# Altium project 6301 Lab 3.PrjPcb
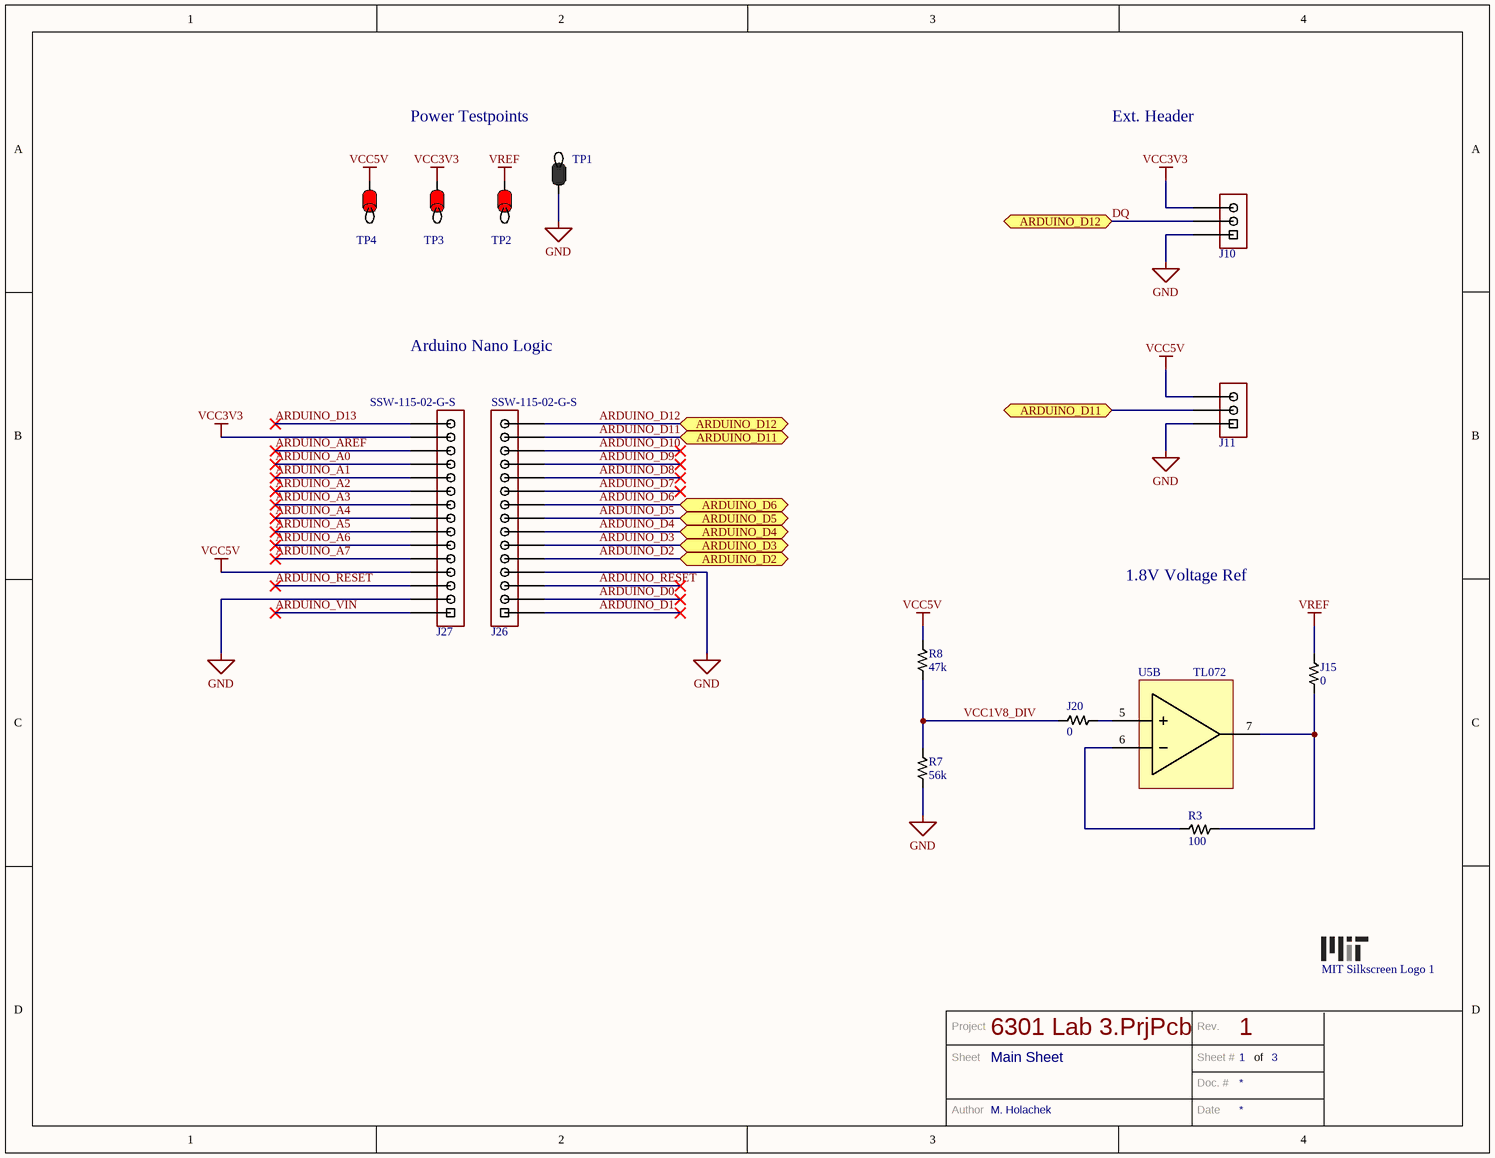
[diagram p0: 6301 Lab3 Main.SchDoc]
3 sheets, 54 parts. Net scope: flat (ports and power ports of the same name join across sheets).
Board file: 6301 Lab3 FF.PcbDoc
Sheets:
  6301 Lab3 Main.SchDoc
  6301 Lab3 ADC.SchDoc
  6301 Lab3 PTAT.SchDoc

## Sheet 6301 Lab3 Main.SchDoc: Main Sheet
size Letter; Author: M. Holachek; Revision: 1; SheetNumber: 1; SheetTotal: 3

### Parts
J10  Short  [1X03]  (value not drawn)
J11  Short  [1X03]  (value not drawn)
J15  0  [JUMP0402]
J20  0  [JUMP0402]
J26  SSW-115-02-G-S  [1x15]
J27  SSW-115-02-G-S  [1x15]
MIT_Silkscreen_Logo_1  MIT Logo  [MITLOGO]  (value not drawn)  (no BOM)
R3  100  [RES0805]
R7  56k  [RES0805]
R8  47k  [RES0805]
TP1  Black  [TP_BLACK]  (value not drawn)
TP2  Red  [TP_RED]  (value not drawn)
TP3  Red  [TP_RED]  (value not drawn)
TP4  Red  [TP_RED]  (value not drawn)
U5  TL072  [SOIC8]  (part B of 2)

### Ports
ARDUINO_D2, ARDUINO_D3, ARDUINO_D4, ARDUINO_D5, ARDUINO_D6, ARDUINO_D11, ARDUINO_D12

### Nets
GND: J10.1 J11.1 J26.4 J27.2 R7.1 TP1.1
VCC3V3: J10.3 J27.14 TP3.1
VCC5V: J11.3 J27.4 R8.2 TP4.1
VREF: J15.2 TP2.1
ARDUINO_A0: J27.12
ARDUINO_A1: J27.11
ARDUINO_A2: J27.10
ARDUINO_A3: J27.9
ARDUINO_A4: J27.8
ARDUINO_A5: J27.7
ARDUINO_A6: J27.6
ARDUINO_A7: J27.5
ARDUINO_AREF: J27.13
ARDUINO_D0: J26.2
ARDUINO_D1: J26.1
ARDUINO_D2: J26.5 ; port ARDUINO_D2  [project net ADC_OUT]
ARDUINO_D3: J26.6 ; port ARDUINO_D3
ARDUINO_D4: J26.7 ; port ARDUINO_D4
ARDUINO_D5: J26.8 ; port ARDUINO_D5
ARDUINO_D6: J26.9 ; port ARDUINO_D6
ARDUINO_D7: J26.10
ARDUINO_D8: J26.11
ARDUINO_D9: J26.12
ARDUINO_D10: J26.13
ARDUINO_D11: J11.2 J26.14 ; port ARDUINO_D11
ARDUINO_D12: J10.2 J26.15 ; port ARDUINO_D12  [also labelled DQ]
ARDUINO_D13: J27.15
ARDUINO_RESET: J26.3 J27.3
ARDUINO_VIN: J27.1
VCC1V8_DIV: J20.1 R7.2 R8.1
NetJ15_1: J15.1 R3.1 U5.7(2OUT)
NetJ20_2: J20.2 U5.5(2IN+)
NetR3_2: R3.2 U5.6(2IN-)

### Notes on the sheet
- Power Testpoints
- Ext. Header
- Arduino Nano Logic
- 1.8V Voltage Ref
- Project
- Rev.
- Sheet
- Author
- Doc. #
- Sheet #
- Date
- of

### Library data of the parts
J10 J11 = 1x3: 1x3 2.54mm Standard Connector
J15 J20 = Jumper 0402: Jumper, 0402 Package
J26 J27 = 1x15: 1x15 2.54mm Standard Connector
R3 R8 = Resistor: Resistor, 0805 Package; Temp Co: +/- 25ppm; Tolerance: 1%
  R8: Digikey P/N: RG20P499KBCT-ND
R7 = Resistor: Resistor, 0805 Package; Temp Co: +/- 25ppm; Tolerance: 0.1%; Digikey P/N: RG20P499KBCT-ND
TP1 = Black Test Point
TP2-TP4 = Red Test Point
U5 = TL07xx: Dual Low-Noise JFET-Input Op Amp

## Sheet 6301 Lab3 ADC.SchDoc: Dual-Slope ADC
size Letter; Author: M. Holachek; Revision: 1; SheetNumber: 3; SheetTotal: 3
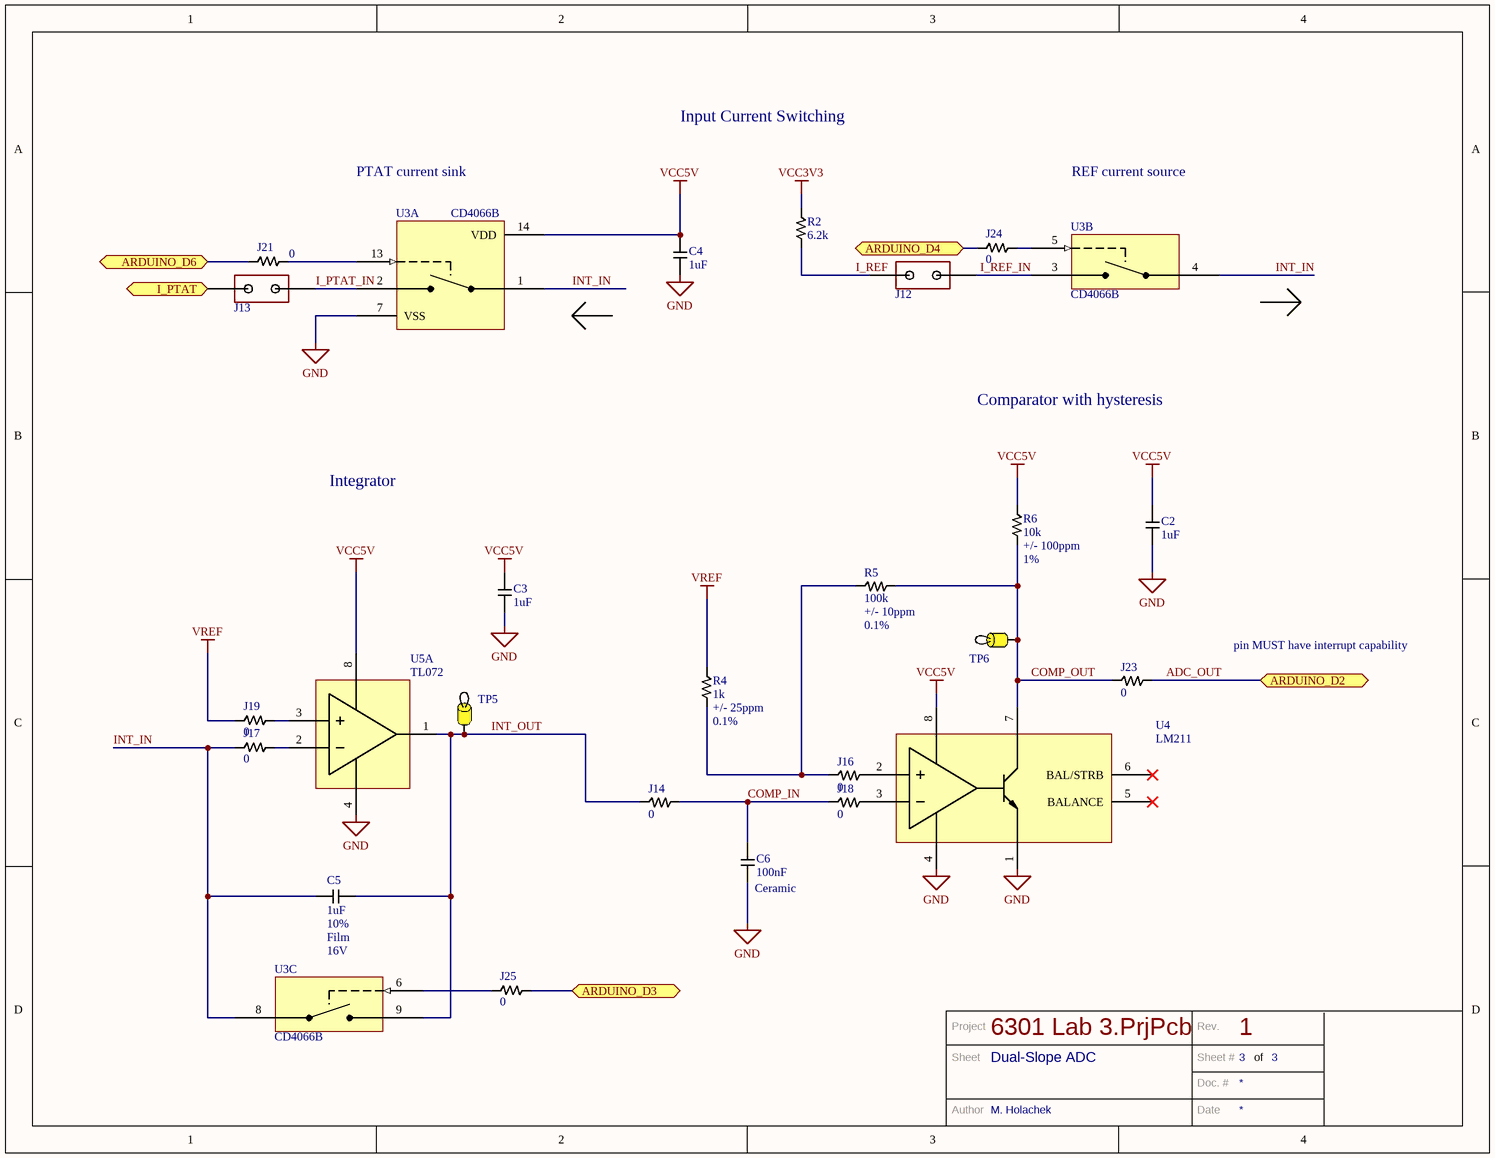
[diagram p1: 6301 Lab3 ADC.SchDoc]

### Parts
C2  1uF  [CAP0805]
C3  1uF  [CAP0805]
C4  1uF  [CAP0805]
C5  1uF  Tolerance: 10%  Type: Film  Voltage: 16V  [CAP0805]
C6  100nF  Type: Ceramic  [CAP0805]
J12  Jumper  [1X02]  (value not drawn)
J13  Jumper  [1X02]  (value not drawn)
J14  0  [JUMP0402]
J16  0  [JUMP0402]
J17  0  [JUMP0402]
J18  0  [JUMP0402]
J19  0  [JUMP0402]
J21  0  [JUMP0402]
J23  0  [JUMP0402]
J24  0  [JUMP0402]
J25  0  [JUMP0402]
R2  6.2k  [RES0805]
R4  1k  Temp Co: +/- 25ppm  Tolerance: 0.1%  [RES0805]
R5  100k  Temp Co: +/- 10ppm  Tolerance: 0.1%  [RES0805]
R6  10k  Temp Co: +/- 100ppm  Tolerance: 1%  [RES0805]
TP5  Yellow  [TP_YELLOW]  (value not drawn)
TP6  Yellow  [TP_YELLOW]  (value not drawn)
U3  CD4066B  [SOIC14]  (parts A,B,C of 4)
U4  LM211  [SOIC8]
U5  TL072  [SOIC8]  (part A of 2)

### Ports
ARDUINO_D2, ARDUINO_D3, ARDUINO_D4, ARDUINO_D6, I_PTAT (out)

### Nets
GND: C2.1 C3.1 C4.1 C6.1 U3.7(VSS) U4.1(EMIT_OUT) U4.4(VCC-) U5.4(VCC-)
VCC3V3: R2.2
VCC5V: C2.2 C3.2 C4.2 R6.2 U3.14(VDD) U4.8(VCC+) U5.8(VCC+)
VREF: J19.1 R4.2
ADC_OUT: J23.1 ; port ARDUINO_D2
ARDUINO_D3: J25.2 ; port ARDUINO_D3
ARDUINO_D4: J24.1 ; port ARDUINO_D4
ARDUINO_D6: J21.1 ; port ARDUINO_D6
COMP_IN: C6.2 J14.1 J18.2
COMP_OUT: J23.2 R5.1 R6.1 TP6.1 U4.7(COL_OUT)
I_PTAT: J13.2 ; port I_PTAT
I_PTAT_IN: J13.1 U3.2(OUT_A)
I_REF: J12.2 R2.1
I_REF_IN: J12.1 U3.3(OUT_B)
INT_IN: C5.1 J17.1 U3.1(IN_A) U3.4(IN_B) U3.8(IN_C)
INT_OUT: C5.2 J14.2 TP5.1 U3.9(OUT_C) U5.1(1OUT)
NetJ16_1: J16.1 U4.2(IN+)
NetJ16_2: J16.2 R4.1 R5.2
NetJ17_2: J17.2 U5.2(1IN-)
NetJ18_1: J18.1 U4.3(IN-)
NetJ19_2: J19.2 U5.3(1IN+)
NetJ21_2: J21.2 U3.13(EN_A)
NetJ24_2: J24.2 U3.5(EN_B)
NetJ25_1: J25.1 U3.6(EN_C)

Not connected (* = marked no-connect by the designer): U4 5(BALANCE)* 6(BAL/STRB)*

### Notes on the sheet
- Input Current Switching
- PTAT current sink
- REF current source
- Comparator with hysteresis
- Integrator
- pin MUST have interrupt capability
- Project
- Rev.
- Sheet
- Author
- Doc. #
- Sheet #
- Date
- of

### Library data of the parts
C2-C4 = Capacitor: Capacitor, 0805 Package; Tolerance: 10%; Type: Ceramic; Voltage: 25V
C5 = Capacitor: Capacitor, 0805 Package
C6 = Capacitor: Capacitor, 0805 Package; Tolerance: 10%; Voltage: 50V; Digikey P/N: 399-1147-1-ND
J12 J13 = 1x2: 1x2 2.54mm Jumper
J14 J16-J19 J21 J23-J25 = Jumper 0402: Jumper, 0402 Package
R2 = Resistor: Resistor, 0805 Package; Temp Co: +/- 10ppm; Tolerance: 0.1%; Digikey P/N: A103679CT-ND
R4-R6 = Resistor: Resistor, 0805 Package
  R4: Digikey P/N: RG20P499KBCT-ND
  R5: Digikey P/N: A103679CT-ND
  R6: Digikey P/N: RMCF0805FT10K0CT-ND
TP5 TP6 = Yellow Test Point
U3 = CD4066B: CMOS Quad Bilateral Switch; Manufacturer P/N: CD4066BEE4; Manufacturer: Texas Instruments; Current Rating: 10mA; Output Voltage Range: 3-18V; Operating Temperature: -55C to 125C; Digikey P/N: 296-36088-5-ND
U4 = LMx11: Single Differential Comparator; Manufacturer P/N: LM311N; Manufacturer: Texas Instruments; Operating Temperature: 0C to 70C; Digikey P/N: LM311N-ND
U5 = TL07xx: Dual Low-Noise JFET-Input Op Amp

## Sheet 6301 Lab3 PTAT.SchDoc: PTAT Temp Sensor
size Letter; Author: M. Holachek; Revision: 1; SheetNumber: 2; SheetTotal: 3
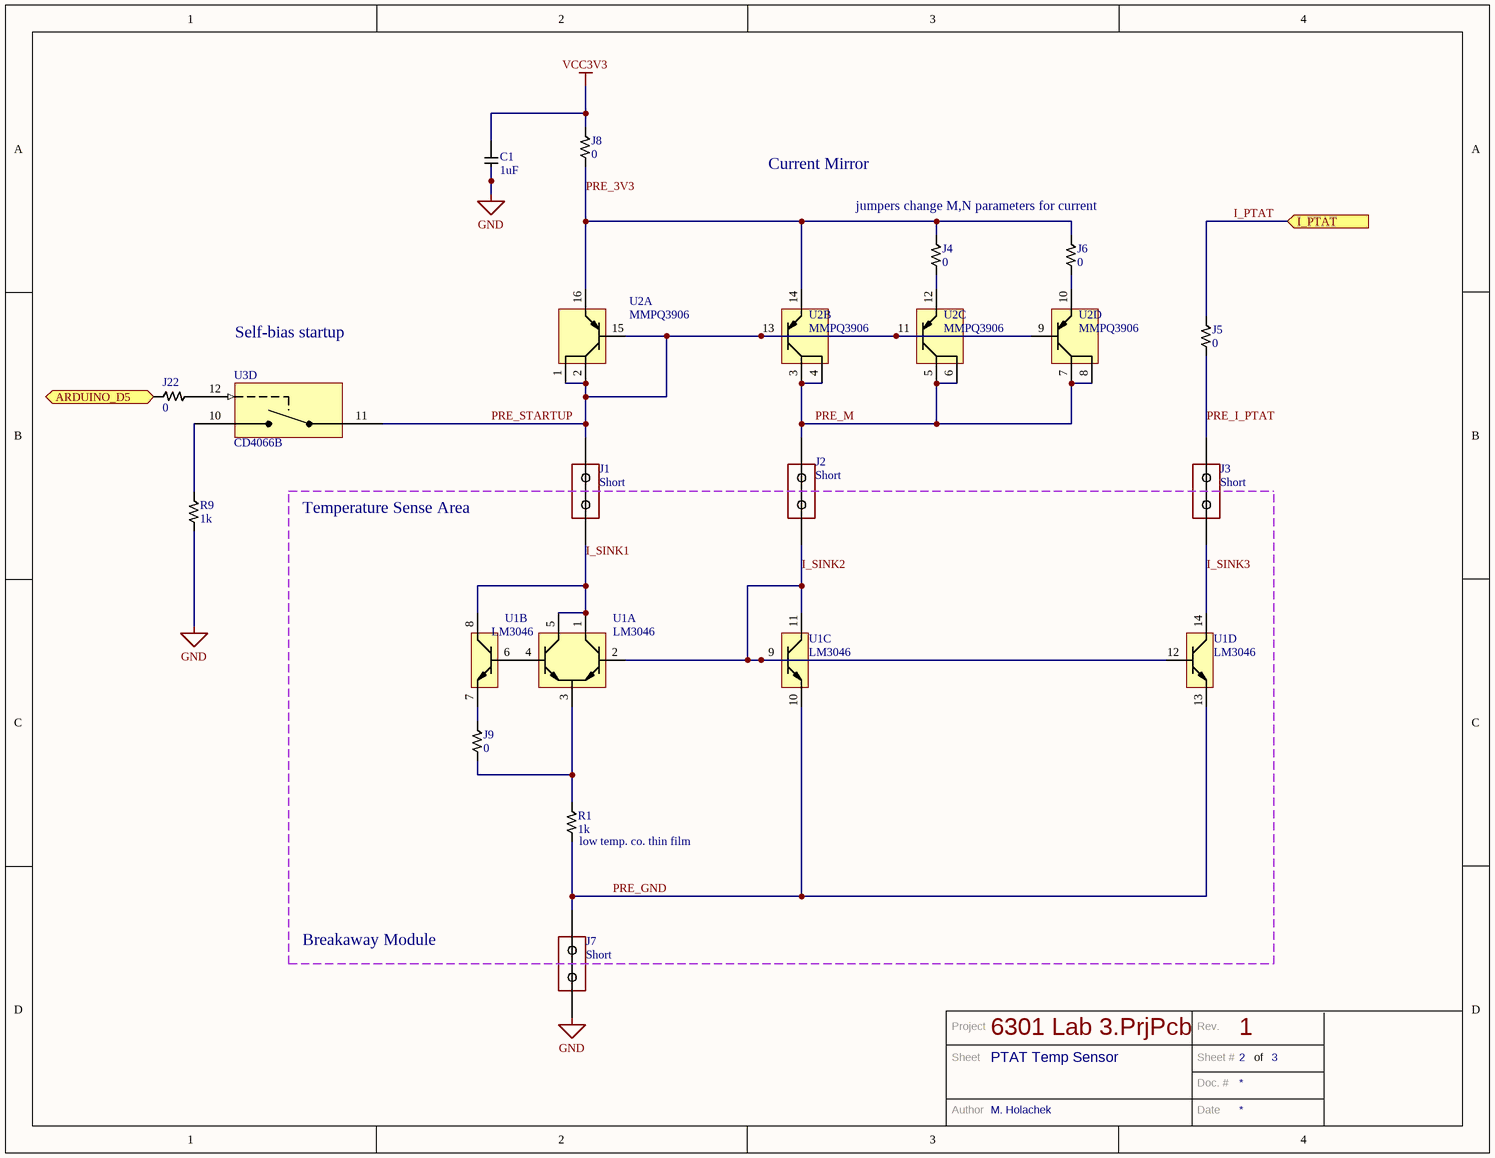
[diagram p2: 6301 Lab3 PTAT.SchDoc]

### Parts
C1  1uF  [CAP0805]
J1  Short  [1X02_SHORT]
J2  Short  [1X02_SHORT]
J3  Short  [1X02_SHORT]
J4  0  [JUMP0402]
J5  0  [JUMP0402]
J6  0  [JUMP0402]
J7  Short  [1X02_SHORT]
J8  0  [JUMP0402]
J9  0  [JUMP0402]
J22  0  [JUMP0402]
R1  1k  [RES0805]
R9  1k  [RES0805]
U1  LM3046  [SOIC14]  (parts A,B,C,D of 4)
U2  MMPQ3906  [SOIC16]  (parts A,B,C,D of 4)
U3  CD4066B  [SOIC14]  (part D of 4)

### Ports
ARDUINO_D5, I_PTAT (in)

### Nets
GND: C1.1 J7.1 R9.1
VCC3V3: C1.2 J8.2
ARDUINO_D5: J22.1 ; port ARDUINO_D5
I_PTAT: J5.2 ; port I_PTAT
I_SINK1: J1.1 U1.1(Q1AC) U1.5(Q1BC) U1.8(Q2C)
I_SINK2: J2.2 U1.2(Q1AB) U1.9(Q3B) U1.11(Q3C) U1.12(Q4B)
I_SINK3: J3.1 U1.14(Q4C)
PRE_3V3: J4.2 J6.2 J8.1 U2.14(Q2E) U2.16(Q1E)
PRE_GND: J7.2 R1.1 U1.10(Q3E) U1.13(Q4E)
PRE_I_PTAT: J3.2 J5.1
PRE_M: J2.1 U2.3(Q2C) U2.4(Q1C) U2.5(Q3C) U2.6(Q1C) U2.7(Q4C) U2.8(Q1C)
PRE_STARTUP: J1.2 U2.1(Q1C) U2.2(Q1C) U2.9(Q4B) U2.11(Q3B) U2.13(Q2B) U2.15(Q1B) U3.11(IN_D)
NetJ4_1: J4.1 U2.12(Q3E)
NetJ6_1: J6.1 U2.10(Q4E)
NetJ9_1: J9.1 R1.2 U1.3(Q1E)
NetJ9_2: J9.2 U1.7(Q2E)
NetJ22_2: J22.2 U3.12(EN_D)
NetR9_2: R9.2 U3.10(OUT_D)
NetU1_4: U1.4(Q1BB) U1.6(Q2B)

### Notes on the sheet
- Current Mirror
- jumpers change M,N parameters for current
- Self-bias startup
- Temperature Sense Area
- (near R1) low temp. co. thin film
- Breakaway Module
- Project
- Rev.
- Sheet
- Author
- Doc. #
- Sheet #
- Date
- of

### Library data of the parts
C1 = Capacitor: as C2 on sheet 6301 Lab3 ADC
J1-J3 J7 = 1x2 Wide Short: Shorted TH pins in wide configuration
J4-J6 J8 J9 J22 = Jumper 0402: Jumper, 0402 Package
R1 = Resistor: as R7 on sheet 6301 Lab3 Main; Digikey P/N: P499DACT-ND
R9 = Resistor: Resistor, 0805 Package; Temp Co: +/- 100ppm; Tolerance: 1%; Digikey P/N: 311-1.00KCRCT-ND
U1 = LM3046: NPN Silicon Quad Transistor Array
U2 = MMPQ3906: PNP Silicon Quad Transistor Array
U3 = CD4066B: as U3 on sheet 6301 Lab3 ADC; Operating Temperature: -55C to 125C; Digikey P/N: 296-36088-5-ND

## Nets that join several sheets
GND: 6301 Lab3 Main (6 pins), 6301 Lab3 ADC (8 pins), 6301 Lab3 PTAT (C1.1 J7.1 R9.1)
VCC3V3: 6301 Lab3 Main (J10.3 J27.14 TP3.1), 6301 Lab3 ADC (R2.2), 6301 Lab3 PTAT (C1.2 J8.2)
VCC5V: 6301 Lab3 Main (J11.3 J27.4 R8.2 TP4.1), 6301 Lab3 ADC (7 pins)
VREF: 6301 Lab3 Main (J15.2 TP2.1), 6301 Lab3 ADC (J19.1 R4.2)
ADC_OUT: 6301 Lab3 Main (J26.5), 6301 Lab3 ADC (J23.1)
ARDUINO_D3: 6301 Lab3 Main (J26.6), 6301 Lab3 ADC (J25.2)
ARDUINO_D4: 6301 Lab3 Main (J26.7), 6301 Lab3 ADC (J24.1)
ARDUINO_D5: 6301 Lab3 Main (J26.8), 6301 Lab3 PTAT (J22.1)
ARDUINO_D6: 6301 Lab3 Main (J26.9), 6301 Lab3 ADC (J21.1)
I_PTAT: 6301 Lab3 ADC (J13.2), 6301 Lab3 PTAT (J5.2)